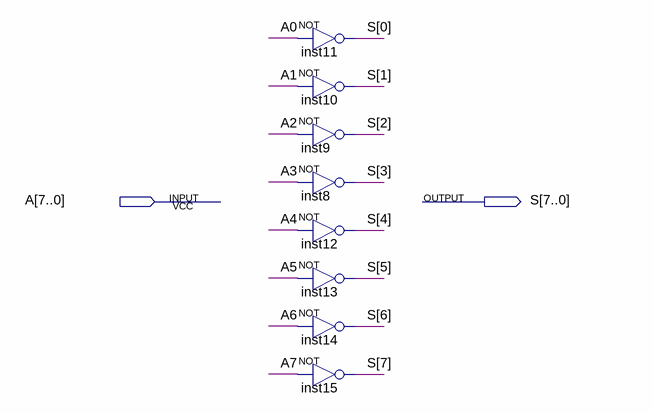
[diagram p0: schematic sheet]
// Quartus schematic NOT_neander.bdf as structural Verilog: 8 symbols, 2 pins
module NOT_neander (
  input  [7:0] A,
  output [7:0] S
);

  not inst11 (S[0], A[0]);
  not inst10 (S[1], A[1]);
  not inst9 (S[2], A[2]);
  not inst8 (S[3], A[3]);
  not inst12 (S[4], A[4]);
  not inst13 (S[5], A[5]);
  not inst14 (S[6], A[6]);
  not inst15 (S[7], A[7]);
endmodule
